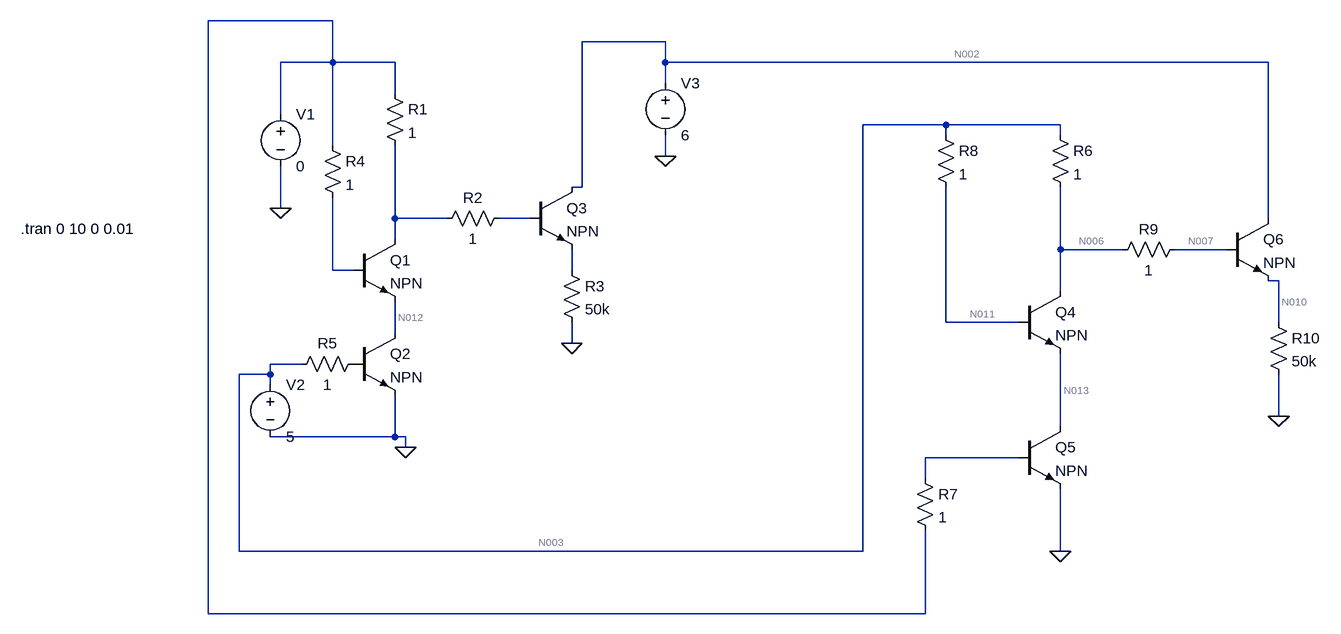
[diagram p0: schematic Draft1.asc]
Draft1.asc, the LTspice schematic file:
Version 4
SHEET 1 1636 688
WIRE 112 -256 -80 -256
WIRE 624 -224 496 -224
WIRE 112 -192 112 -256
WIRE 112 -192 32 -192
WIRE 208 -192 112 -192
WIRE 624 -192 624 -224
WIRE 1552 -192 624 -192
WIRE 624 -160 624 -192
WIRE 208 -144 208 -192
WIRE 32 -112 32 -192
WIRE 1056 -96 928 -96
WIRE 1232 -96 1056 -96
WIRE 1056 -80 1056 -96
WIRE 1232 -80 1232 -96
WIRE 112 -64 112 -192
WIRE 624 -48 624 -80
WIRE 496 0 496 -224
WIRE 496 0 480 0
WIRE 32 32 32 -32
WIRE 208 48 208 -64
WIRE 288 48 208 48
WIRE 416 48 368 48
WIRE 1552 48 1552 -192
WIRE 208 80 208 48
WIRE 1232 96 1232 0
WIRE 1328 96 1232 96
WIRE 1488 96 1408 96
WIRE 112 128 112 16
WIRE 144 128 112 128
WIRE 480 128 480 96
WIRE 1568 144 1552 144
WIRE 1232 160 1232 96
WIRE 1056 208 1056 0
WIRE 1168 208 1056 208
WIRE 1568 208 1568 144
WIRE 208 224 208 176
WIRE 480 240 480 208
WIRE 64 272 16 272
WIRE 16 288 16 272
WIRE 16 288 -32 288
WIRE 16 304 16 288
WIRE 1568 352 1568 288
WIRE 1232 368 1232 256
WIRE 208 384 208 320
WIRE 208 384 16 384
WIRE 224 384 208 384
WIRE 224 400 224 384
WIRE 1168 416 1024 416
WIRE 1024 448 1024 416
WIRE -32 560 -32 288
WIRE 928 560 928 -96
WIRE 928 560 -32 560
WIRE 1232 560 1232 464
WIRE -80 656 -80 -256
WIRE 1024 656 1024 528
WIRE 1024 656 -80 656
FLAG 224 400 0
FLAG 32 32 0
FLAG 480 240 0
FLAG 624 -48 0
FLAG 1232 560 0
FLAG 1568 352 0
SYMBOL npn 144 80 R0
SYMATTR InstName Q1
SYMBOL npn 144 224 R0
SYMATTR InstName Q2
SYMBOL npn 416 0 R0
SYMATTR InstName Q3
SYMBOL res 192 -160 R0
SYMATTR InstName R1
SYMATTR Value 1
SYMBOL res 384 32 R90
WINDOW 0 0 56 VBottom 2
WINDOW 3 32 56 VTop 2
SYMATTR InstName R2
SYMATTR Value 1
SYMBOL voltage 32 -128 R0
WINDOW 123 0 0 Left 0
WINDOW 39 0 0 Left 0
SYMATTR InstName V1
SYMATTR Value 0
SYMBOL voltage 16 288 R0
WINDOW 123 0 0 Left 0
WINDOW 39 0 0 Left 0
SYMATTR InstName V2
SYMATTR Value 5
SYMBOL res 464 112 R0
SYMATTR InstName R3
SYMATTR Value 50k
SYMBOL res 96 -80 R0
SYMATTR InstName R4
SYMATTR Value 1
SYMBOL voltage 624 -176 R0
WINDOW 123 0 0 Left 0
WINDOW 39 0 0 Left 0
SYMATTR InstName V3
SYMATTR Value 6
SYMBOL res 160 256 R90
WINDOW 0 0 56 VBottom 2
WINDOW 3 32 56 VTop 2
SYMATTR InstName R5
SYMATTR Value 1
SYMBOL npn 1168 160 R0
SYMATTR InstName Q4
SYMBOL npn 1168 368 R0
SYMATTR InstName Q5
SYMBOL npn 1488 48 R0
SYMATTR InstName Q6
SYMBOL res 1216 -96 R0
SYMATTR InstName R6
SYMATTR Value 1
SYMBOL res 1008 432 R0
SYMATTR InstName R7
SYMATTR Value 1
SYMBOL res 1040 -96 R0
SYMATTR InstName R8
SYMATTR Value 1
SYMBOL res 1424 80 R90
WINDOW 0 0 56 VBottom 2
WINDOW 3 32 56 VTop 2
SYMATTR InstName R9
SYMATTR Value 1
SYMBOL res 1552 192 R0
SYMATTR InstName R10
SYMATTR Value 50k
TEXT -368 64 Left 2 !.tran 0 10 0 0.01

The netlist it stands for:
* Draft1.asc
Q1 N004 N008 N012 0 NPN
Q2 N012 P001 0 0 NPN
Q3 N002 N005 N009 0 NPN
R1 N001 N004 1
R2 N005 N004 1
V1 N001 0 0
V2 N003 0 5
R3 N009 0 50k
R4 N001 N008 1
V3 N002 0 6
R5 P001 N003 1
Q4 N006 N011 N013 0 NPN
Q5 N013 N014 0 0 NPN
Q6 N002 N007 N010 0 NPN
R6 N003 N006 1
R7 N014 N001 1
R8 N003 N011 1
R9 N007 N006 1
R10 N010 0 50k
.model NPN NPN
.model PNP PNP
.lib standard.bjt
.tran 0 10 0 0.01
.backanno
.end

* Results of the author's LTspice run, read from the files saved beside the schematic
* Operating Point, zero values left out:
*   V(n012) = 17.93 mV
*   V(p001) = 1.006 V
*   V(n002) = 6 V
*   V(n003) = 5 V
*   V(n006) = 5 V
*   V(n011) = 5 V
*   V(n013) = 4.723 V
*   V(n007) = 5 V
*   V(n010) = 4.29 V
*   Ic(Q6) = 84.94 µA
*   Ib(Q6) = 849.4 nA
*   Ie(Q6) = -85.79 µA
*   Ic(Q5) = 4.723 pA
*   Ib(Q5) = -4.723 pA
*   Ic(Q4) = 4.474 pA
*   Ie(Q4) = -4.796 pA
*   Ic(Q3) = 6 pA
*   Ib(Q3) = -6 pA
*   Ib(Q2) = 3.994 A
*   Ie(Q2) = -3.994 A
*   I(R10) = 85.79 µA
*   I(R9) = -849.4 nA
*   I(R7) = 4.723 pA
*   I(R6) = 849.4 nA
*   I(R5) = -3.994 A
*   I(R2) = 6 pA
*   I(R1) = -6 pA
*   I(V3) = -84.94 µA
*   I(V2) = -3.994 A
*   I(V1) = 10.74 pA